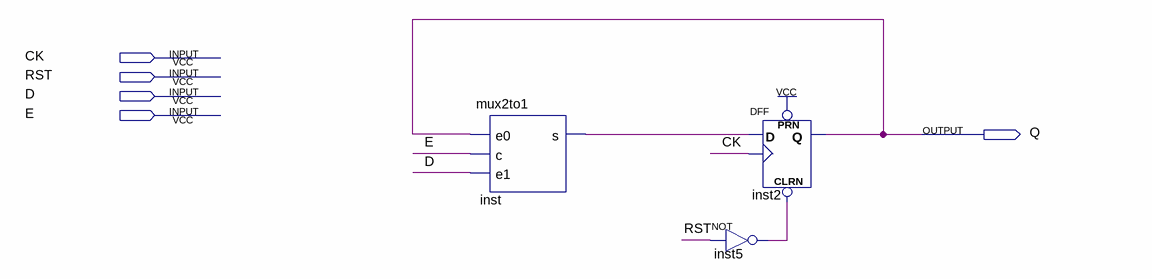
[diagram p0: schematic sheet]
// Quartus schematic ff_enable.bdf as structural Verilog: 3 symbols, 5 pins
module ff_enable (
  input  CK,
  input  RST,
  input  D,
  input  E,
  output Q
);

  wire inst5_out, inst_s;

  mux2to1 inst (.e0(Q), .c(E), .e1(D), .s(inst_s));
  DFF inst2 (.CLRN(inst5_out), .CLK(CK), .D(inst_s), .PRN(1'b1), .Q(Q));
  not inst5 (inst5_out, RST);
endmodule
